# EAGLE design arduino (EAGLE 7.3.0)
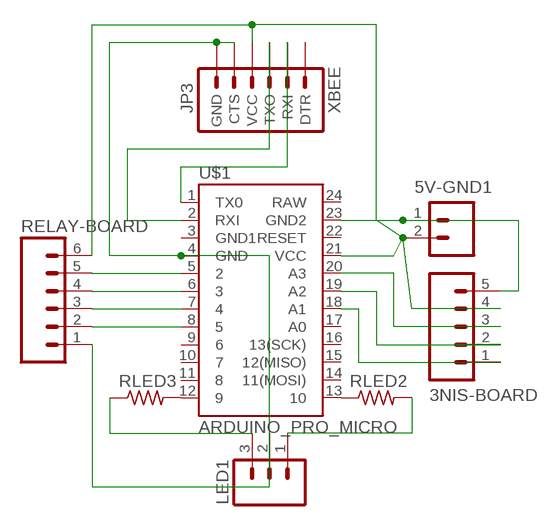
[diagram p0: schematic, sheet 1]

## Parts
3NIS-BOARD  M05PTH  [1X05]
5V-GND1  M025MM  [SCREWTERMINAL-5MM-2]
JP3  XBEE  ARDUINO_SERIAL_PROGRAMPTH  [1X06]
LED1  M03PTH  [1X03]
RELAY-BOARD  M06SIP  [1X06]
RLED2  R-US_M0805  [M0805]
RLED3  R-US_M0805  [M0805]
U$1  ARDUINO_PRO_MICRO  [ARDUINO_PRO_MICRO]

## Nets
N$1: JP3.5(CTS) JP3.6(GND) LED1.2 RELAY-BOARD.1 U$1.4(GND)
N$2: 3NIS-BOARD.4 5V-GND1.2 JP3.4(VCC) RELAY-BOARD.6 U$1.21(VCC)
N$3: 3NIS-BOARD.3 U$1.20(A3)
N$4: RELAY-BOARD.5 U$1.5
N$5: RELAY-BOARD.4 U$1.6
N$6: RELAY-BOARD.3 U$1.7
N$7: RELAY-BOARD.2 U$1.8
N$8: JP3.2(RXI) U$1.1(TX0)
N$9: 3NIS-BOARD.2 U$1.19(A2)
N$10: JP3.3(TXO) U$1.2(RXI)
N$11: 3NIS-BOARD.1 U$1.18(A1)
N$17: RLED2.1 U$1.13
N$18: RLED3.2 U$1.12
N$19: LED1.1 RLED2.2
N$20: LED1.3 RLED3.1
N$22: 3NIS-BOARD.5 5V-GND1.1 U$1.23(GND2)
Unconnected: JP3.1(DTR) U$1.3(GND1) U$1.9 U$1.10 U$1.11 U$1.14(11(MOSI)) U$1.15(12(MISO)) U$1.16(13(SCK)) U$1.17(A0) U$1.22(RESET) U$1.24(RAW)

## Library data of the parts
3NIS-BOARD = SparkFun-Connectors:M05: Header 5 Standard 5-pin 0.1" header. Use with straight break away headers (SKU : PRT-00116), right angle break away headers (PRT-00553), swiss pins (PRT-00743), machine pins (PRT-00117), and female headers (PRT-00115). Molex polarized connector foot print use with SKU : PRT-08230 with associated crimp pins and housings.
5V-GND1 = SparkFun-Connectors:M02: Header 2 Standard 2-pin 0.1" header. Use with straight break away headers (SKU : PRT-00116), right angle break away headers (PRT-00553), swiss pins (PRT-00743), machine pins (PRT-00117), and female headers (PRT-00115). Molex polarized connector foot print use with SKU : PRT-08233 with associated crimp pins and housings.
JP3 = SparkFun-Connectors:ARDUINO_SERIAL_PROGRAM: FTDI connector footprints
LED1 = SparkFun-Connectors:M03: Header 3 Standard 3-pin 0.1" header. Use with straight break away headers (SKU : PRT-00116), right angle break away headers (PRT-00553), swiss pins (PRT-00743), machine pins (PRT-00117), and female headers (PRT-00115). Molex polarized connector foot print use with SKU : PRT-08232 with associated crimp pins and housings.
RELAY-BOARD = SparkFun-Connectors:M06: Header 6 Standard 6-pin 0.1" header. Use with straight break away headers (SKU : PRT-00116), right angle break away headers (PRT-00553), swiss pins (PRT-00743), machine pins (PRT-00117), and female headers (PRT-00115). Molex polarized connector foot print use with SKU : PRT-08094 with associated crimp pins and housings. NOTES ON THE VARIANTS LOCK and LOCK_LONGPADS... This footprint was designed to help hold the alignment of a through-hole component (i.e. 6-pin header) while soldering it into place. You may notice that each hole has been shifted either up or down by 0.005 of an inch from it's more standard position (which is a perfectly straight line). This slight alteration caused the pins (the squares in the middle) to touch the edges of the holes. Because they are alternating, it causes a "brace" to hold the component in place. 0.005 has proven to be the perfect amount of "off-center" position when using our standard breakaway headers. Although looks a little odd when you look at the bare footprint, once you have a header in there, the alteration is very hard to notice. Also,if you push a header all the way into place, it is covered up entirely on the bottom side. This idea of altering the position of holes to aid alignment will be further integrated into the Sparkfun Library for other footprints. It can help hold any component with 3 or more connection pins.
RLED2 RLED3 = adafruit:R-US_: RESISTOR, American symbol
U$1 = SparkFun-Boards:ARDUINO_PRO_MICRO

## Board
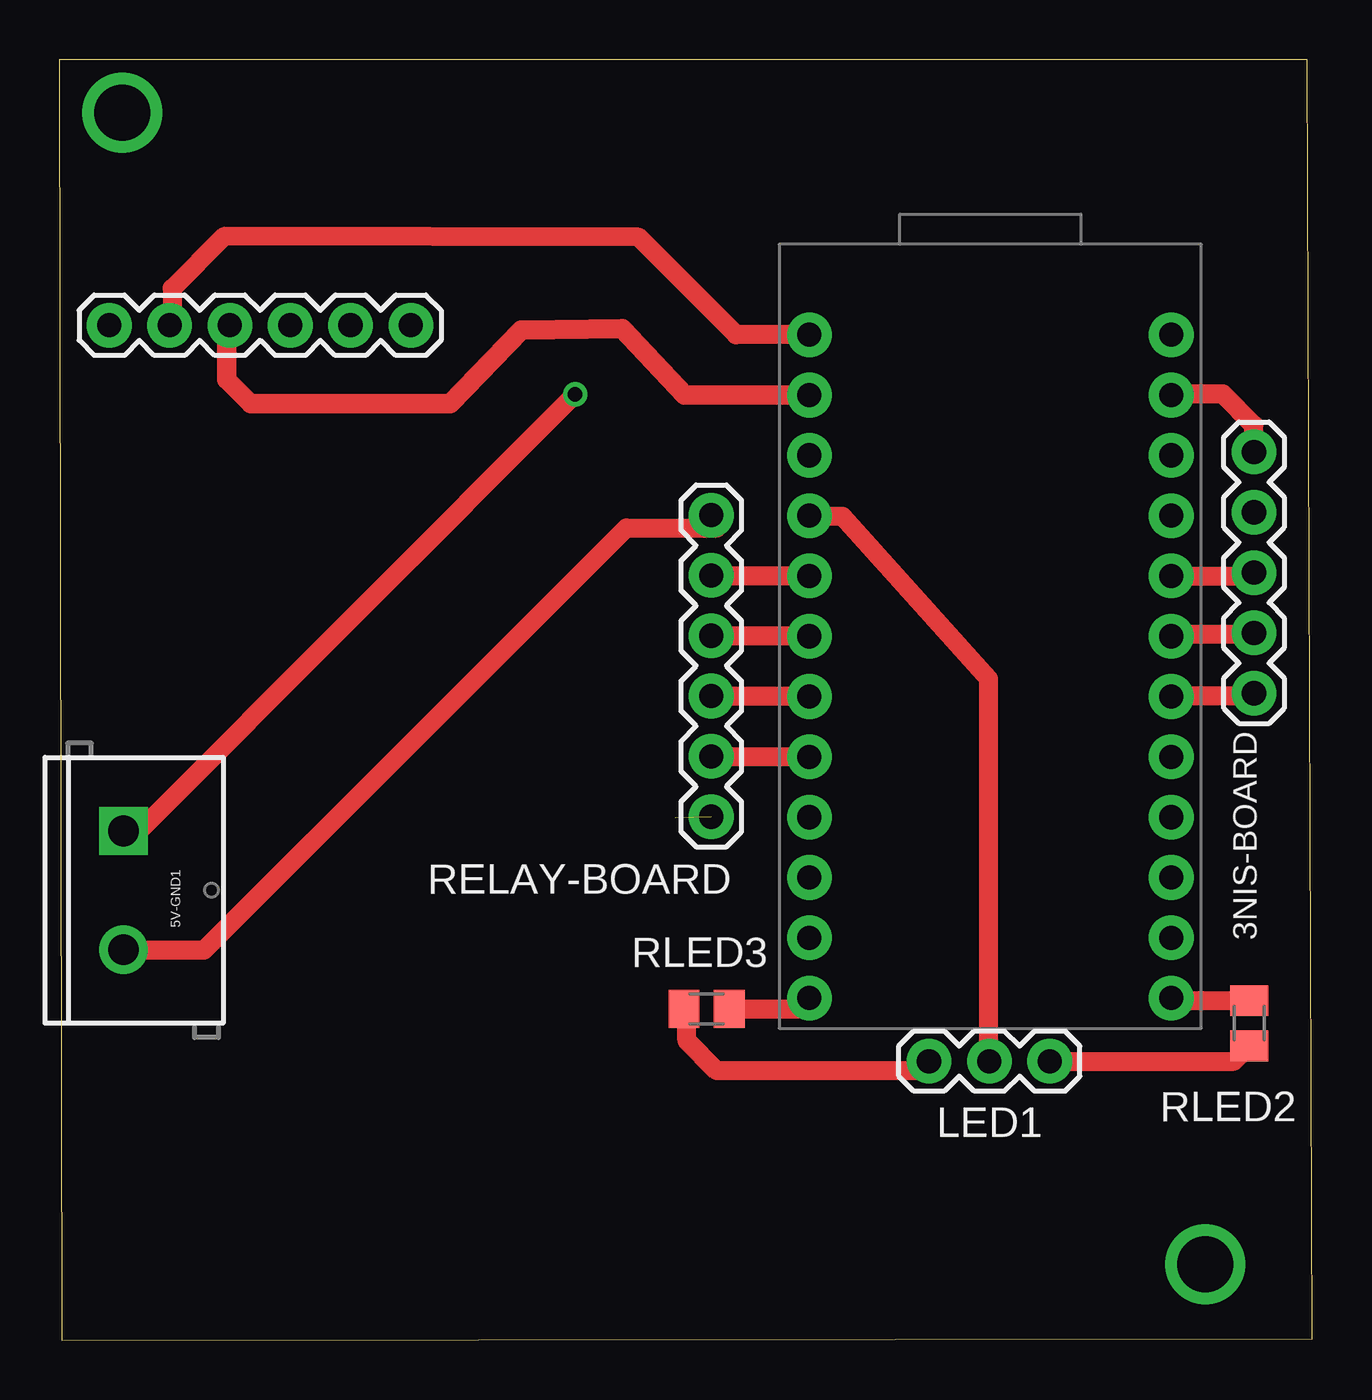
[diagram p1: board, top side]
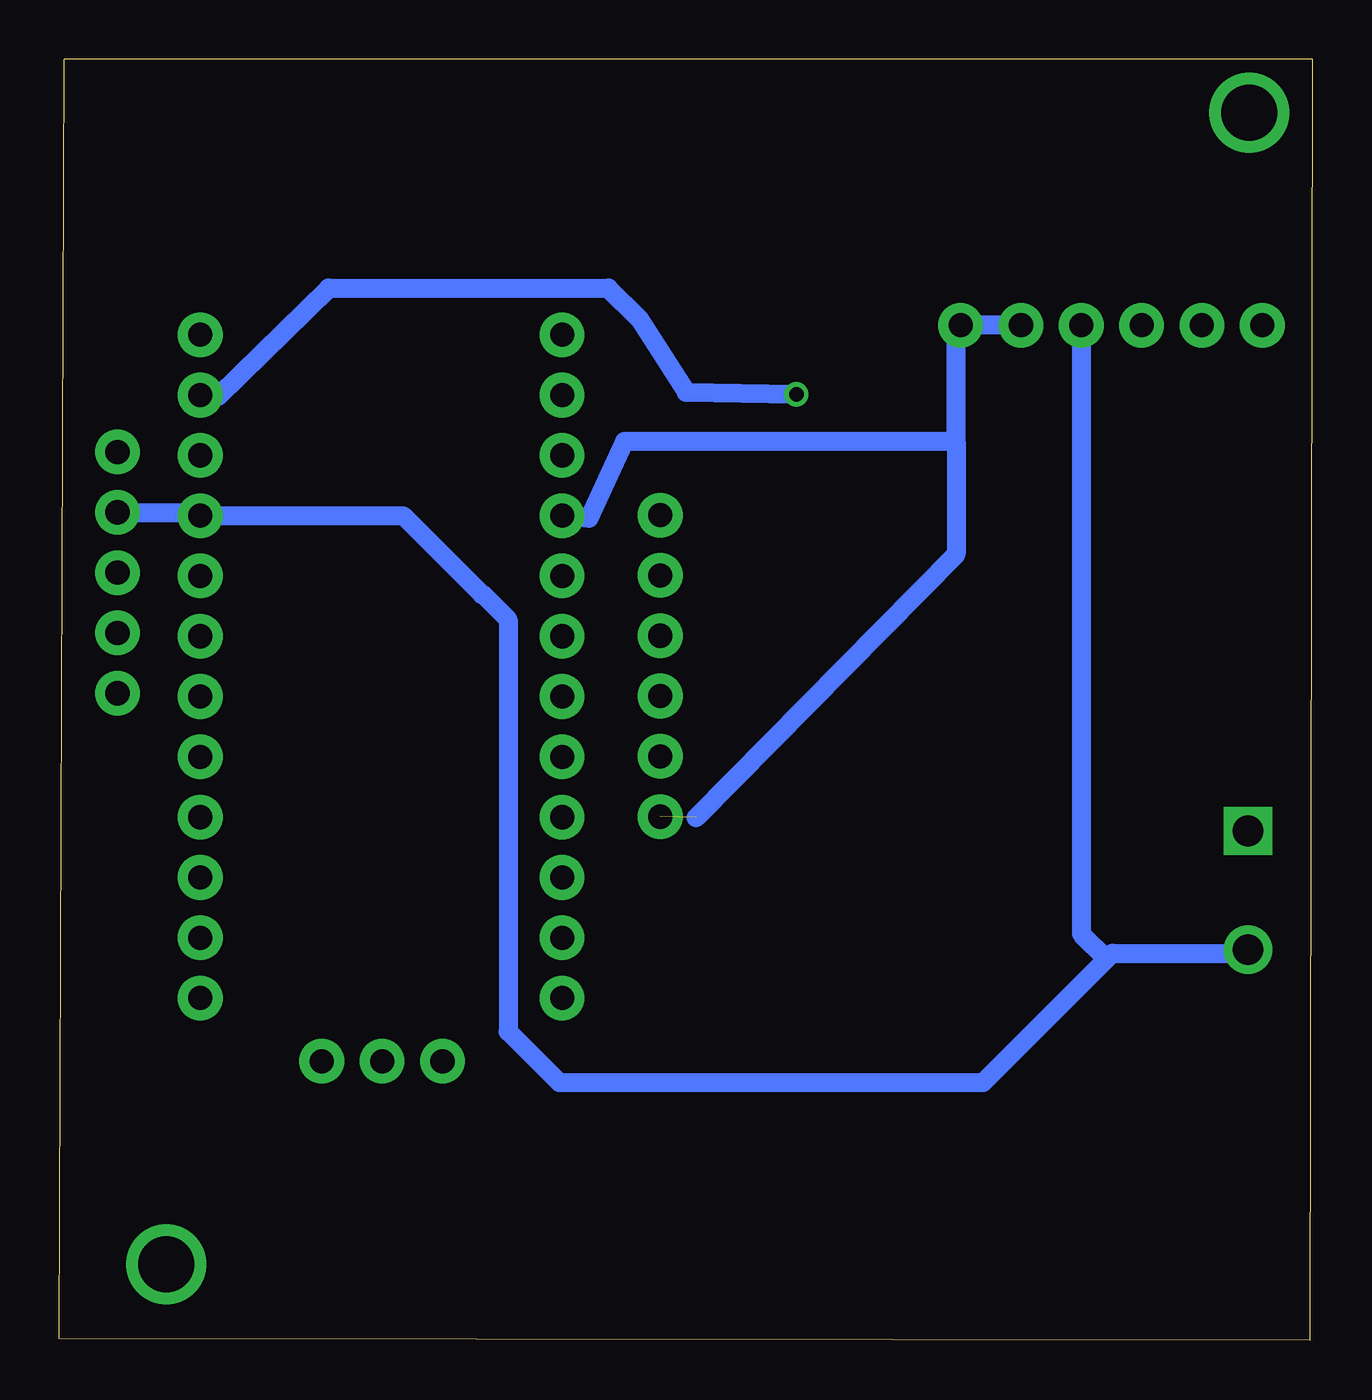
[diagram p2: board, bottom side, seen from below]

Size 52.75 x 53.95 mm. Coordinates in mm from the lower left corner, seen from the top.
Outline: 0.1,0 52.75,0.05 52.55,53.95 0,53.95 0.1,0
Copper layers (1*16): Top 0.035mm / dielectric 1.5mm / Bottom 0.035mm
Design rules "default": minimum track width 0.8mm, minimum drill 24mil, track to track 20mil, track to pad 20mil, pad to pad 20mil, via to via 20mil, smd to smd 8mil, copper to edge 40mil, drill to drill 10mil, minimum pad ring 10mil, minimum via ring 8mil, stop-mask expansion 4mil, vias tented up to drill 0mil, thermal gap 10mil

### Footprints (pad centres in the part's own frame; a part is rotated, then mirrored left to right if it is on the bottom)
1X05 = drill 1.016 pad 1.88: 1 0,0; 2 2.54,0; 3 5.08,0; 4 7.62,0; 5 10.16,0
SCREWTERMINAL-5MM-2 = drill 1.3 pad 2.032 square: 1 0,0 | drill 1.3 pad 2.032: 2 5,0
1X06 = drill 1.016 pad 1.88: 1 0,0; 2 2.54,0; 3 5.08,0; 4 7.62,0; 5 10.16,0; 6 12.7,0
1X03 = drill 1.016 pad 1.88: 1 0,0; 2 2.54,0; 3 5.08,0
M0805 = smd 1.3 x 1.6: 1 -0.95,0; 2 0.95,0
ARDUINO_PRO_MICRO = drill 1.016 pad 1.88: 1 -7.62,12.7; 2 -7.62,10.16; 3 -7.62,7.62; 4 -7.62,5.08; 5 -7.62,2.54; 6 -7.62,0; 7 -7.62,-2.54; 8 -7.62,-5.08; 9 -7.62,-7.62; 10 -7.62,-10.16; 11 -7.62,-12.7; 12 -7.62,-15.24; 13 7.62,-15.24; 14 7.62,-12.7; 15 7.62,-10.16; 16 7.62,-7.62; 17 7.62,-5.08; 18 7.62,-2.54; 19 7.62,0; 20 7.62,2.54; 21 7.62,5.08; 22 7.62,7.62; 23 7.62,10.16; 24 7.62,12.7

### Placement (x,y rotation side)
3NIS-BOARD  50.3,27.25 90 top
5V-GND1  2.7,21.45 270 top
JP3  2.1,42.75 0 top
LED1  41.7,11.75 180 top
RELAY-BOARD  27.45,22.05 90 top
RLED2  50.1,13.35 270 top
RLED3  27.25,13.95 0 top
U$1  39.2,29.65 0 top

### Tracks (layer width: path | path; a pad name or v marks a point on that pad's centre or on a via)
N$1  (1 unrouted)
  Top 0.8: LED1.2 39.12,11.35 39.12,27.86 32.97,34.71 31.7,34.71 U$1.4
  Bottom 0.8: 25.94,22.01 14.99,33.11 14.99,37.85 | 14.99,37.85 28.96,37.85 30.45,34.61 U$1.4 | JP3.5 JP3.6 14.99,43.21 14.99,37.85
N$2
  Top 0.8: RELAY-BOARD.6 27.69,34.21 23.88,34.21 6.1,16.43 2.87,16.43 5V-GND1.2
  Bottom 0.8: 3NIS-BOARD.4 46.96,34.87 U$1.21 38.28,34.73 34.95,31.4 34.9,31.4 33.85,30.35 33.85,13 31.7,10.85 13.85,10.85 8.65,16.05 | 8.65,16.05 8.4,16.3 2.85,16.3 5V-GND1.2 | JP3.4 9.72,17.12 8.65,16.05
N$3
  Top 0.8: U$1.20 46.69,32.17 50.5,32.17 3NIS-BOARD.3
N$4
  Top 0.8: RELAY-BOARD.5 31.56,32.21 U$1.5
N$5
  Top 0.8: RELAY-BOARD.4 31.56,29.67 U$1.6
N$6
  Top 0.8: RELAY-BOARD.3 31.56,27.13 U$1.7
N$7
  Top 0.8: RELAY-BOARD.2 31.56,24.59 U$1.8
N$8
  Top 0.8: U$1.1 28.5,42.35 24.4,46.45 6.95,46.5 4.75,44.3 4.75,42.51 JP3.2
N$9
  Top 0.8: U$1.19 46.84,29.73 50.65,29.73 3NIS-BOARD.2
N$10
  Top 0.813: U$1.2 26.34,39.81 23.7,42.6 19.45,42.55 16.45,39.45 8.05,39.45 7.05,40.45 7.05,42.62 JP3.3
N$11
  Top 0.8: U$1.18 46.69,27.14 50.5,27.14 3NIS-BOARD.1
N$12  (via drill 2.36)
  other vias: 48.25,3.2
N$16  (via drill 2.36)
  other vias: 2.65,51.7
N$17
  Top 0.8: RLED2.1 46.93,14.3 U$1.13
N$18
  Top 0.8: RLED3.2 31.12,13.95 U$1.12
N$19
  Top 0.8: LED1.1 49.45,11.75 RLED2.2
N$20
  Top 0.8: RLED3.1 26.42,13.89 26.42,12.62 27.69,11.35 36.58,11.35 LED1.3
N$22  (via drill 0.61)
  Top 0.8: v21.72,39.84 3.39,21.46 3.02,21.46 5V-GND1.1 | 3NIS-BOARD.5 50.3,38.55 49,39.85 46.86,39.85 U$1.23
  Bottom 0.8: v21.72,39.84 26.36,39.93 28.36,43.05 29.63,44.32 41.41,44.32 46.09,39.74 U$1.23